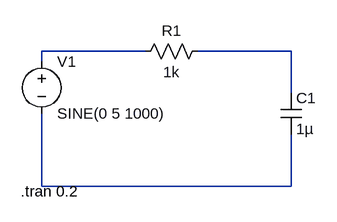
[diagram p0: schematic Series_RC.asc]
Series_RC.asc, the LTspice schematic file:
Version 4.1
SHEET 1 880 680
WIRE 160 80 0 80
WIRE 384 80 240 80
WIRE 0 96 0 80
WIRE 384 144 384 80
WIRE 0 288 0 176
WIRE 384 288 384 208
WIRE 384 288 0 288
SYMBOL voltage 0 80 R0
WINDOW 123 0 0 Left 0
WINDOW 39 0 0 Left 0
SYMATTR InstName V1
SYMATTR Value SINE(0 5 1000)
SYMBOL res 256 64 R90
WINDOW 0 0 56 VBottom 2
WINDOW 3 32 56 VTop 2
SYMATTR InstName R1
SYMATTR Value 1k
SYMBOL cap 368 144 R0
SYMATTR InstName C1
SYMATTR Value 1µ
TEXT -32 296 Left 2 !.tran 0.2

The netlist it stands for:
* Series_RC.asc
V1 N001 N003 SINE(0 5 1000)
R1 N002 N001 1k
C1 N002 N003 1µ
.tran 0.2
.backanno
.end